# EAGLE design MyAmpV2 (EAGLE 9.0.1)
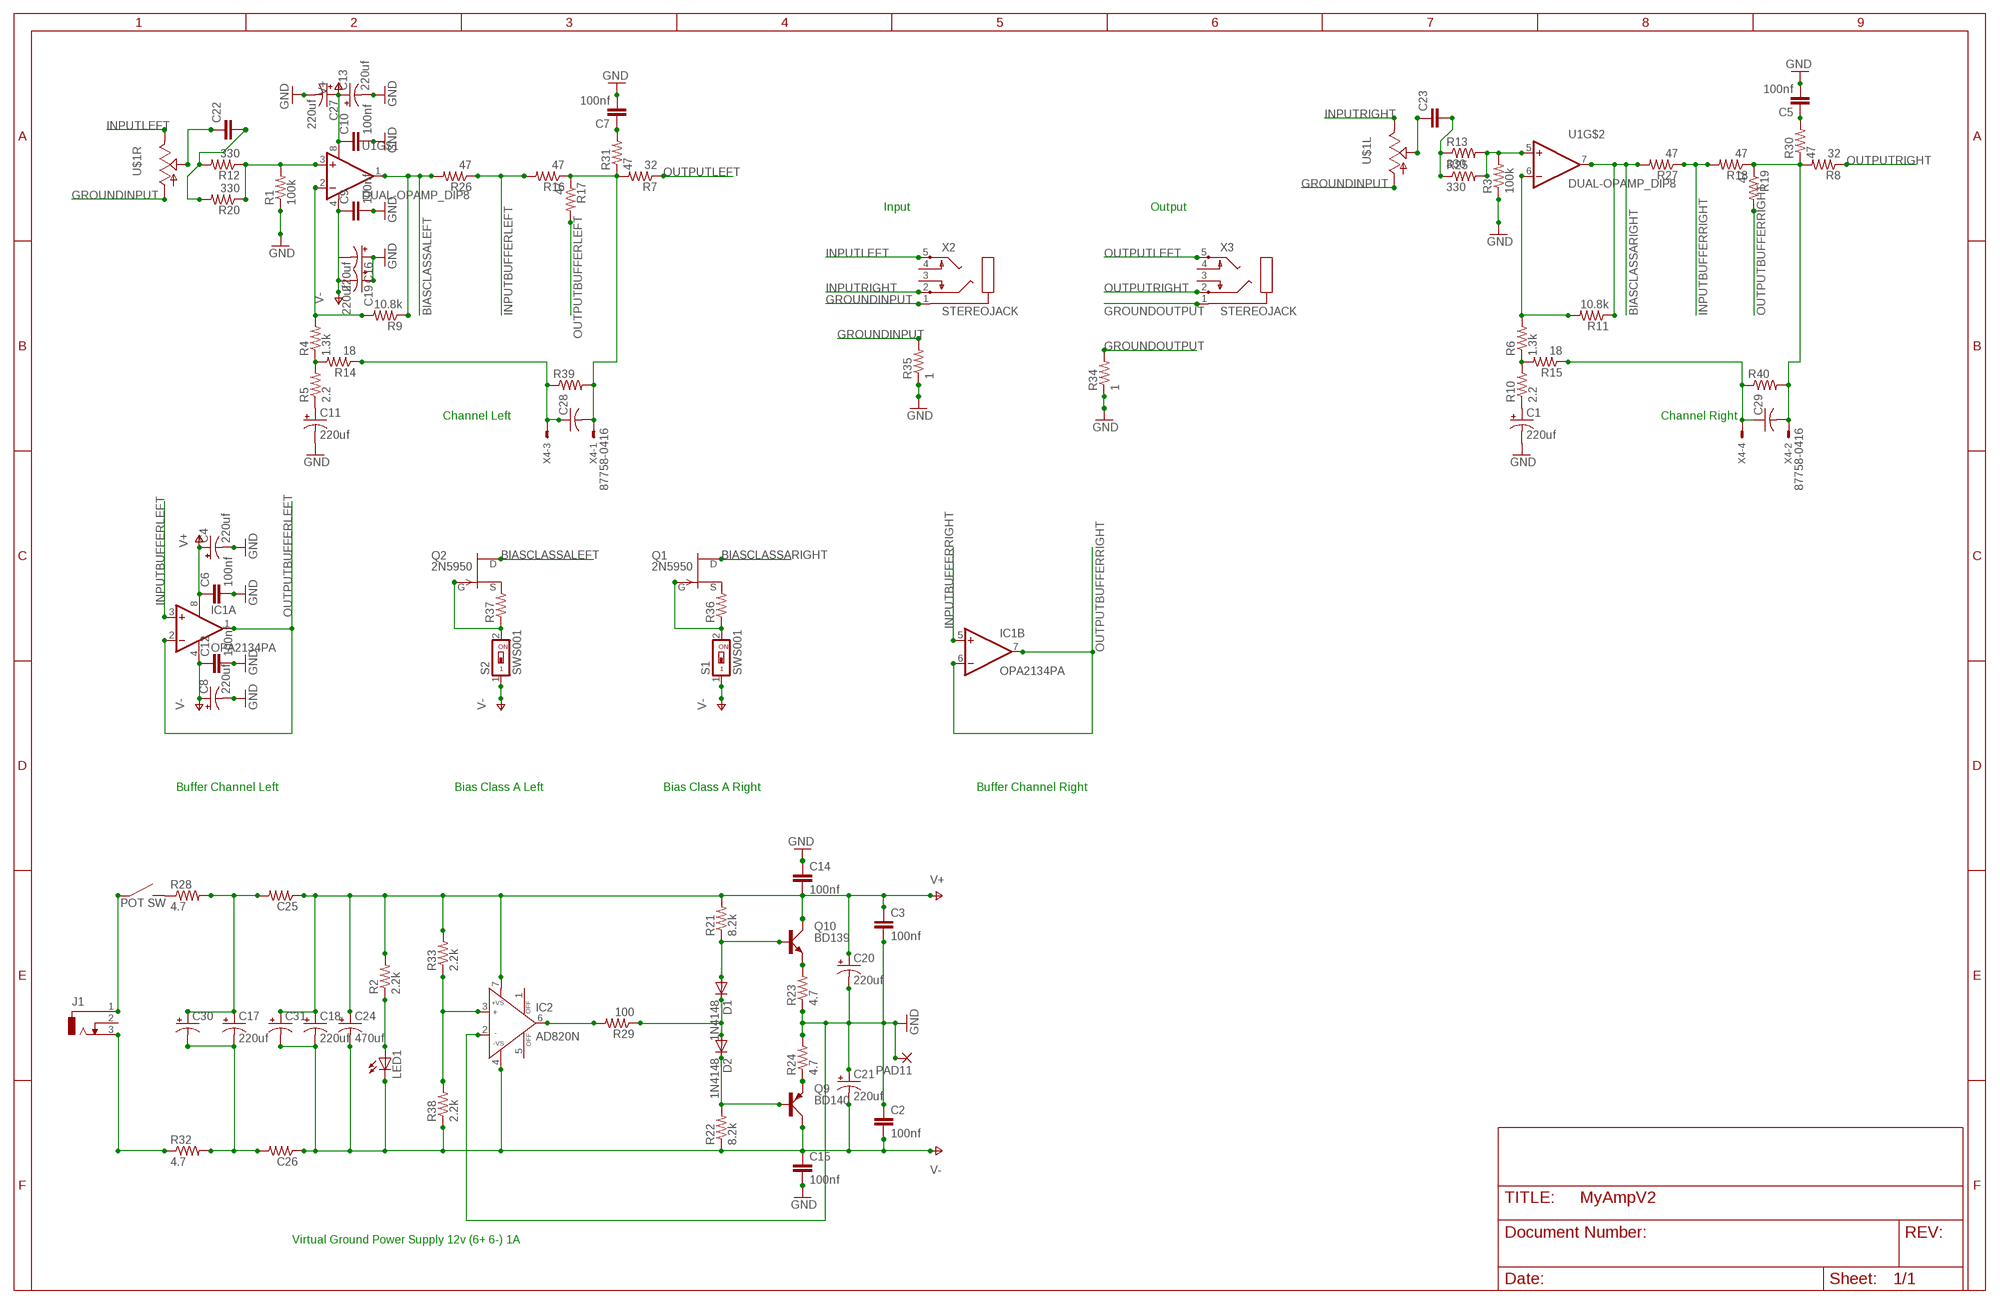
[diagram p0: schematic, sheet 1]

## Parts
C1  220uf  CPOL-USE5-10.5  [E5-10,5]
C2  100nf  C5/2.5  [C5B2.5]
C3  100nf  C5/2.5  [C5B2.5]
C4  220uf  CPOL-USE5-10.5  [E5-10,5]
C5  100nf  C5/2.5  [C5B2.5]
C6  100nf  C5/2.5  [C5B2.5]
C7  100nf  C5/2.5  [C5B2.5]
C8  220uf  CPOL-USE5-10.5  [E5-10,5]
C9  100nf  C5/2.5  [C5B2.5]
C10  100nf  C5/2.5  [C5B2.5]
C11  220uf  CPOL-USE5-10.5  [E5-10,5]
C12  100nf  C5/2.5  [C5B2.5]
C13  220uf  CPOL-USE5-10.5  [E5-10,5]
C14  100nf  C5/2.5  [C5B2.5]
C15  100nf  C5/2.5  [C5B2.5]
C16  220uf  CPOL-USE5-10.5  [E5-10,5]
C17  220uf  CPOL-USE5-10.5  [E5-10,5]
C18  220uf  CPOL-USE5-10.5  [E5-10,5]
C19  220uf  CPOL-USE5-10.5  [E5-10,5]
C20  220uf  CPOL-USD/7343-31R  [D/7343-31R]
C21  220uf  CPOL-USD/7343-31R  [D/7343-31R]
C22  C22/6  [C22.5B6]
C23  C22/6  [C22.5B6]
C24  470uf  CPOL-USE5-10.5  [E5-10,5]
C25  R-US_0207/12  [0207/12]
C26  R-US_0207/12  [0207/12]
C27  220uf  CPOL-USE5-10.5  [E5-10,5]
C28  C-USC1206K  [C1206K]
C29  C-USC1206K  [C1206K]
C30  CPOL-USE7.5-16  [E7,5-16]
C31  CPOL-USE7.5-16  [E7,5-16]
D1  1N4148  1N4148DO35-7  [DO35-7]
D2  1N4148  1N4148DO35-7  [DO35-7]
IC1  OPA2134PA  [DIL08]
IC2  AD820N  [DIL08]
J1  DCJ0303  [DCJ0303]
LED1  LED3MM  [LED3MM]
PAD11  1,6/0,9  [1,6/0,9]
Q1  2N5950  [TO-92]
Q2  2N5950  [TO-92]
Q9  BD140  [TO126AV]
Q10  BD139  [TO126AV]
R1  100k  R-US_0207/10  [0207/10]
R2  2.2k  R-US_0207/10  [0207/10]
R3  100k  R-US_0207/10  [0207/10]
R4  1.3k  R-US_0207/10  [0207/10]
R5  2.2  R-US_0204/5  [0204/5]
R6  1.3k  R-US_0207/10  [0207/10]
R7  32  R-US_0207/12  [0207/12]
R8  32  R-US_0207/12  [0207/12]
R9  10.8k  R-US_0207/10  [0207/10]
R10  2.2  R-US_0204/5  [0204/5]
R11  10.8k  R-US_0207/10  [0207/10]
R12  330  R-US_0207/10  [0207/10]
R13  330  R-US_0207/10  [0207/10]
R14  18  R-US_0207/12  [0207/12]
R15  18  R-US_0207/12  [0207/12]
R16  47  R-US_0207/12  [0207/12]
R17  47  R-US_0207/12  [0207/12]
R18  47  R-US_0207/12  [0207/12]
R19  47  R-US_0207/12  [0207/12]
R20  330  R-US_0207/10  [0207/10]
R21  8.2k  R-US_0207/10  [0207/10]
R22  8.2k  R-US_0207/10  [0207/10]
R23  4.7  R-US_0207/10  [0207/10]
R24  4.7  R-US_0207/10  [0207/10]
R25  330  R-US_0207/10  [0207/10]
R26  47  R-US_0207/10  [0207/10]
R27  47  R-US_0207/10  [0207/10]
R28  4.7  R-US_0207/10  [0207/10]
R29  100  R-US_0207/10  [0207/10]
R30  47  R-US_0207/7  [0207/7]
R31  47  R-US_0207/7  [0207/7]
R32  4.7  R-US_0207/10  [0207/10]
R33  2.2k  R-US_0207/10  [0207/10]
R34  1  R-US_0207/7  [0207/7]
R35  1  R-US_0207/7  [0207/7]
R36  R-US_0204/5  [0204/5]
R37  R-US_0204/5  [0204/5]
R38  2.2k  R-US_0207/10  [0207/10]
R39  R-US_MELF0204W  [MINI_MELF-0204W]
R40  R-US_MELF0204W  [MINI_MELF-0204W]
S1  SWS001  [SMS-001]
S2  SWS001  [SMS-001]
U1  DUAL-OPAMP_DIP8  [DIP-8]
U$1  ALPS_RK0971221Z05  [ALPS_RK0971221Z0X]
X2  STEREOJACK  [STX3100]
X3  STEREOJACK  [STX3100]
X4  87758-0416  [87758-0416]

## Nets
BIASCLASSALEFT: Q2.3(D) R9.1 R26.2 U1.1(OUT)
BIASCLASSARIGHT: Q1.3(D) R11.1 R27.2 U1.7(OUT)
GND: C1.- C2.1 C3.2 C4.- C5.2 C6.2 C7.2 C8.- C9.2 C10.2 C11.- C12.2 C13.- C14.1 C15.2 C16.+ C19.+ C20.- C21.+ C27.- IC2.2(IN-) PAD11.1(P) R1.1 R3.1 R23.1 R24.2 R34.1 R35.1
GROUNDINPUT: R35.2 U$1.G1 U$1.G2 X2.1
GROUNDOUTPUT: R34.2 X3.1
INPUTBUFFERLEFT: IC1.3(A:+IN) R16.2 R26.1
INPUTBUFFERRIGHT: IC1.5(B:+IN) R18.2 R27.1
INPUTLEFT: U$1.I2 X2.5
INPUTRIGHT: U$1.I1 X2.2
N$1: R1.2 R12.1 R20.1 U1.3(+IN)
N$2: C1.+ R10.1
N$3: C22.2 R12.2 R20.2
N$4: C11.+ R5.1
N$5: IC2.6(OUT) R29.2
N$6: Q10.E R23.2
N$7: IC2.3(IN+) R33.1 R38.2
N$8: Q9.E R24.1
N$9: C22.1 U$1.O2
N$10: R3.2 R13.2 R25.2 U1.5(+IN)
N$11: C23.2 R13.1 R25.1
N$12: R4.1 R5.2 R14.2
N$13: R4.2 R9.2 U1.2(-IN)
N$14: R6.1 R10.2 R15.2
N$15: C23.1 U$1.O1
N$16: C29.1 R15.1 R40.1 X4.4
N$17: C28.2 R7.2 R16.1 R17.1 R31.1 R39.2 X4.1
N$18: R6.2 R11.2 U1.6(-IN)
N$19: C28.1 R14.1 R39.1 X4.3
N$21: R28.1 U$1.S2
N$22: J1.3 R32.1
N$23: C29.2 R8.2 R18.1 R19.1 R30.1 R40.2 X4.2
N$25: LED1.A R2.1
N$26: J1.1 U$1.S1
N$28: C5.1 R30.2
N$29: D1.A Q10.B R21.1
N$30: D2.C Q9.B R22.2
N$33: C17.+ C25.2 C30.+ R28.2
N$36: D1.C D2.A R29.1
N$37: C7.1 R31.2
N$40: C17.- C26.2 C30.- R32.2
N$41: Q1.2(S) R36.2
N$43: Q2.1(G) R37.1 S2.2
N$44: Q1.1(G) R36.1 S1.2
N$45: Q2.2(S) R37.2
OUTPUTBUFFERLEFT: IC1.1(A:OUT) IC1.2(A:-IN) R17.2
OUTPUTBUFFERRIGHT: IC1.6(B:-IN) IC1.7(B:OUT) R19.2
OUTPUTLEFT: R7.1 X3.5
OUTPUTRIGHT: R8.1 X3.2
V+: C3.1 C4.+ C6.1 C10.1 C13.+ C14.2 C18.+ C20.+ C24.+ C25.1 C27.+ C31.+ IC1.8(A:V+) IC2.7(+VS) Q10.C R2.2 R21.2 R33.2 U1.8(V+)
V-: C2.2 C8.+ C9.1 C12.1 C15.1 C16.- C18.- C19.- C21.- C24.- C26.1 C31.- IC1.4(A:V-) IC2.4(-VS) LED1.K(C) Q9.C R22.1 R38.1 S1.1 S2.1 U1.4(V-)
Unconnected: IC2.1(OFF) IC2.5(OFF) J1.2 X2.3 X2.4 X3.3 X3.4

## Notes on the sheet
- Input | Output
- Channel Left | Channel Right
- Buffer Channel Left | Bias Class A Left | Bias Class A Right | Buffer Channel Right
- Virtual Ground Power Supply 12v (6+ 6-) 1A

## Library data of the parts
C1 C4 C8 C11 C13 C16-C21 C24 C27 C30 C31 = rcl:CPOL-US: POLARIZED CAPACITOR, American symbol; SPICEPREFIX: C
C2 C3 C5-C7 C9 C10 C12 C14 C15 C22 C23 = capacitor-wima:C: CAPACITOR naming: grid - package width
C25 C26 R1 R3-R6 R9-R13 R20 R25 R30 R31 R34 R35 R39 R40 = resistor:R-US_: RESISTOR, American symbol
C28 C29 = rcl:C-US: CAPACITOR, American symbol; SPICEPREFIX: C
D1 D2 = diode:1N4148: DIODE high speed (Philips)
IC1 = linear:OPA2*: Dual Operational Amplifier Low Power, Single-Supply, Rail-To-Rail Operational Amplifier Source: http://focus.ti.com/lit/ds/symlink/opa2345.pdf http://focus.ti.com .. opa241.pdf http://focus.ti.com/lit/ds/symlink/opa2134.pdf
IC2 = analog-devices:AD820N: Single-Supply, Rail-to-Rail, Low Power, FET Input Op Amp Source: http://www.analog.com/static/imported-files/data_sheets/AD820.pdf; OC_FARNELL: 1438579; OC_NEWARK: unknown
J1 = con-jack:DCJ0303: DC POWER JACK Source: DCJ0303.pdf
LED1 = led:LED: LED OSRAM: - CHIPLED LG R971, LG N971, LY N971, LG Q971, LY Q971, LO R971, LY R971 LH N974, LH R974 LS Q976, LO Q976, LY Q976 LO Q996 - Hyper CHIPLED LW Q18S LB Q993, LB Q99A, LB R99A - SideLED LS A670, LO A670, LY A670, LG A670, LP A670 LB A673, LV A673, LT A673, LW A673 LH A674 LY A675 LS A676, LA A676, LO A676, LY A676, LW A676 LS A679, LY A679, LG A679 - Hyper Micro SIDELED® LS Y876, LA Y876, LO Y876, LY Y876 LT Y87S - SmartLED LW L88C, LW L88S LB L89C, LB L89S, LG L890 LS L89K, LO L89K, LY L89K LS L896, LA L896, LO L896, LY L896 - TOPLED LS T670, LO T670, LY T670, LG T670, LP T670 LSG T670, LSP T670, LSY T670, LOP T670, LYG T670 LG T671, LOG T671, LSG T671 LB T673, LV T673, LT T673, LW T673 LH T674 LS T676, LA T676, LO T676, LY T676, LB T676, LH T676, LSB T676, LW T676 LB T67C, LV T67C, LT T67C, LS T67K, LO T67K, LY T67K, LW E67C LS E67B, LA E67B, LO E67B, LY E67B, LB E67C, LV E67C, LT E67C LW T67C LS T679, LY T679, LG T679 LS T770, LO T770, LY T770, LG T770, LP T770 LB T773, LV T773, LT T773, LW T773 LH T774 LS E675, LA E675, LY E675, LS T675 LS T776, LA T776, LO T776, LY T776, LB T776 LHGB T686 LT T68C, LB T68C - Hyper Mini TOPLED® LB M676 - Mini TOPLED Santana® LG M470 LS M47K, LO M47K, LY M47K Source: http://www.osram.convergy.de LUXEON: - LUMILED® LXK2-PW12-R00, LXK2-PW12-S00, LXK2-PW14-U00, LXK2-PW14-V00 LXK2-PM12-R00, LXK2-PM12-S00, LXK2-PM14-U00 LXK2-PE12-Q00, LXK2-PE12-R00, LXK2-PE12-S00, LXK2-PE14-T00, LXK2-PE14-U00 LXK2-PB12-K00, LXK2-PB12-L00, LXK2-PB12-M00, LXK2-PB14-N00, LXK2-PB14-P00, LXK2-PB14-Q00 LXK2-PR12-L00, LXK2-PR12-M00, LXK2-PR14-Q00, LXK2-PR14-R00 LXK2-PD12-Q00, LXK2-PD12-R00, LXK2-PD12-S00 LXK2-PH12-R00, LXK2-PH12-S00 LXK2-PL12-P00, LXK2-PL12-Q00, LXK2-PL12-R00 Source: www.luxeon.com KINGBRIGHT: KA-3528ASYC Source: www.kingbright.com
PAD11 = wirepad:1,6/0,9: THROUGH-HOLE PAD
Q1 Q2 = transistor-fet:2N5950: N-Channel JFET RF Amplifier
Q9 = transistor-power:BD140: PNP TRANSISTOR
Q10 = transistor-power:BD139: NPN TRANSISTOR
R2 R7 R8 R14-R19 R21-R24 R26-R29 R32 R33 R36-R38 = resistor@1:R-US_: RESISTOR, American symbol
S1 S2 = smd-special:SWS001: SMD Dip Switch 1 pol.
U1 = opamps:DUAL-OPAMP: Generic 2-channel DIP-8 opamp
U$1 = audio-pots:ALPS_RK0971221Z0*: ALPS RK0971221Z Dual-gang 9mm potentiometer for volume control, with SPST switch -05 model: 10K with "volume" taper -0N model: 50K with traditional audio taper
X2 X3 = adafruit:STEREOJACK: MIC/HEADPHONE JACK Stereo jack with two switches. Kycon STX3100, CUI SJ1-3555NG and/or 4UCon 05544
X4 = con-molex:87758-0416: 4 Pin - 2mm Dual Row Single Wafer, Vertical T/H HDR Source: http://www.molex.com/pdm_docs/sd/877580616_sd.pdf; MF: FARNELL; MPN: 87758-0416; OC_FARNELL: 7472315; OC_NEWARK: 39K3681

## Net classes
0 default: width 0.152 mm, drill 0.152 mm, clearance 0.66 mm

## Board
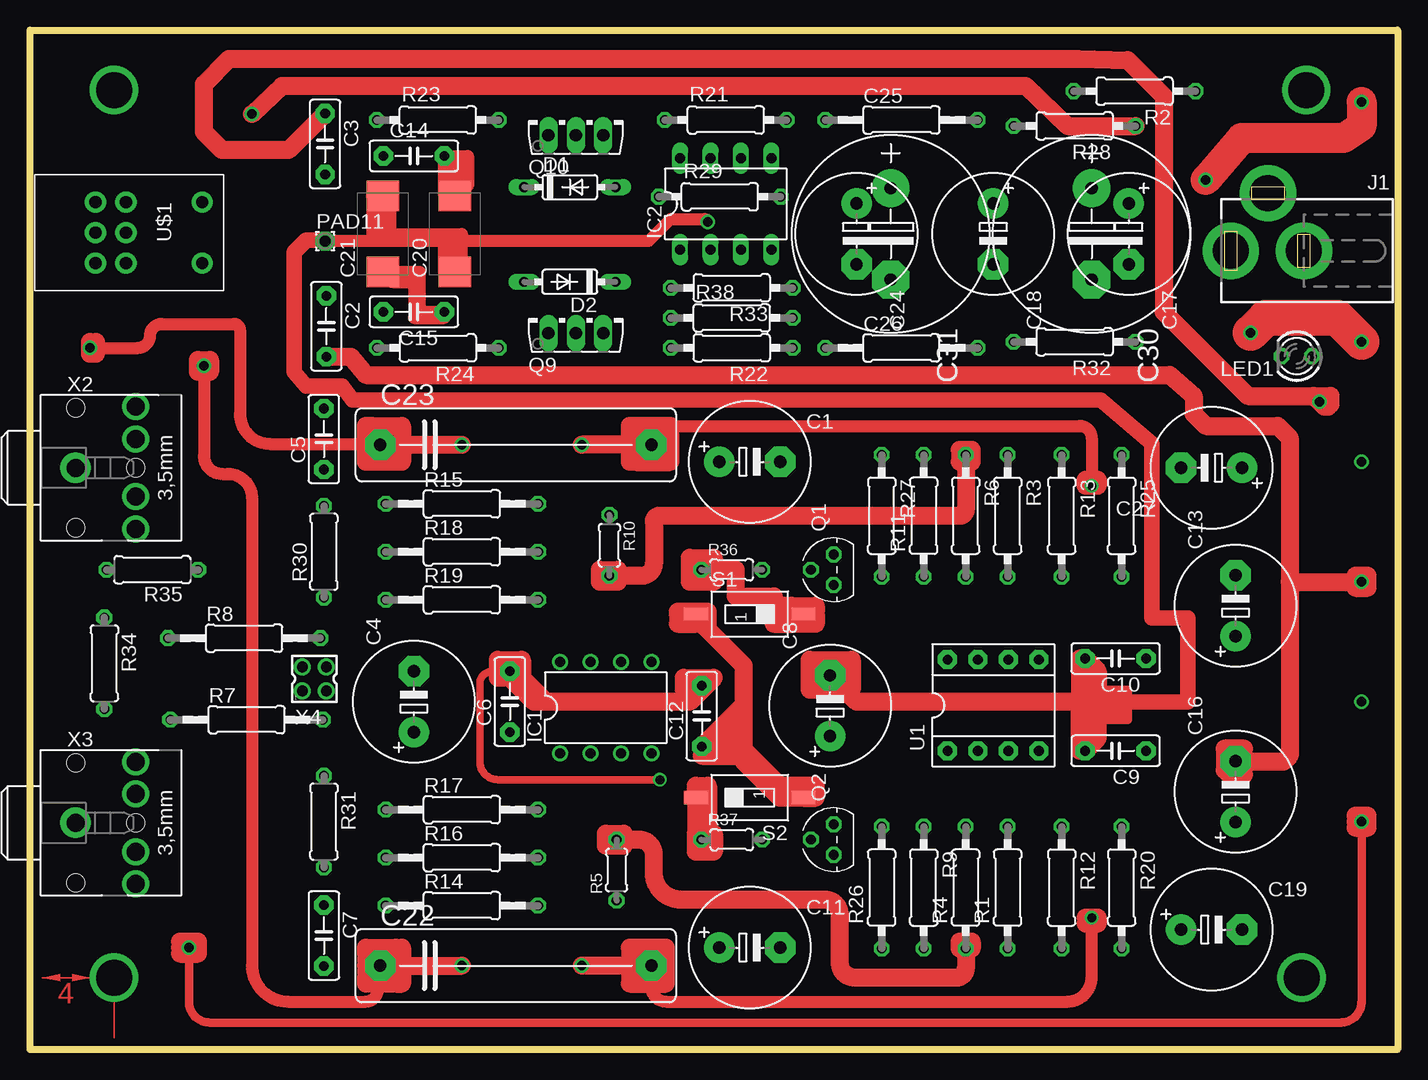
[diagram p1: board, top side]
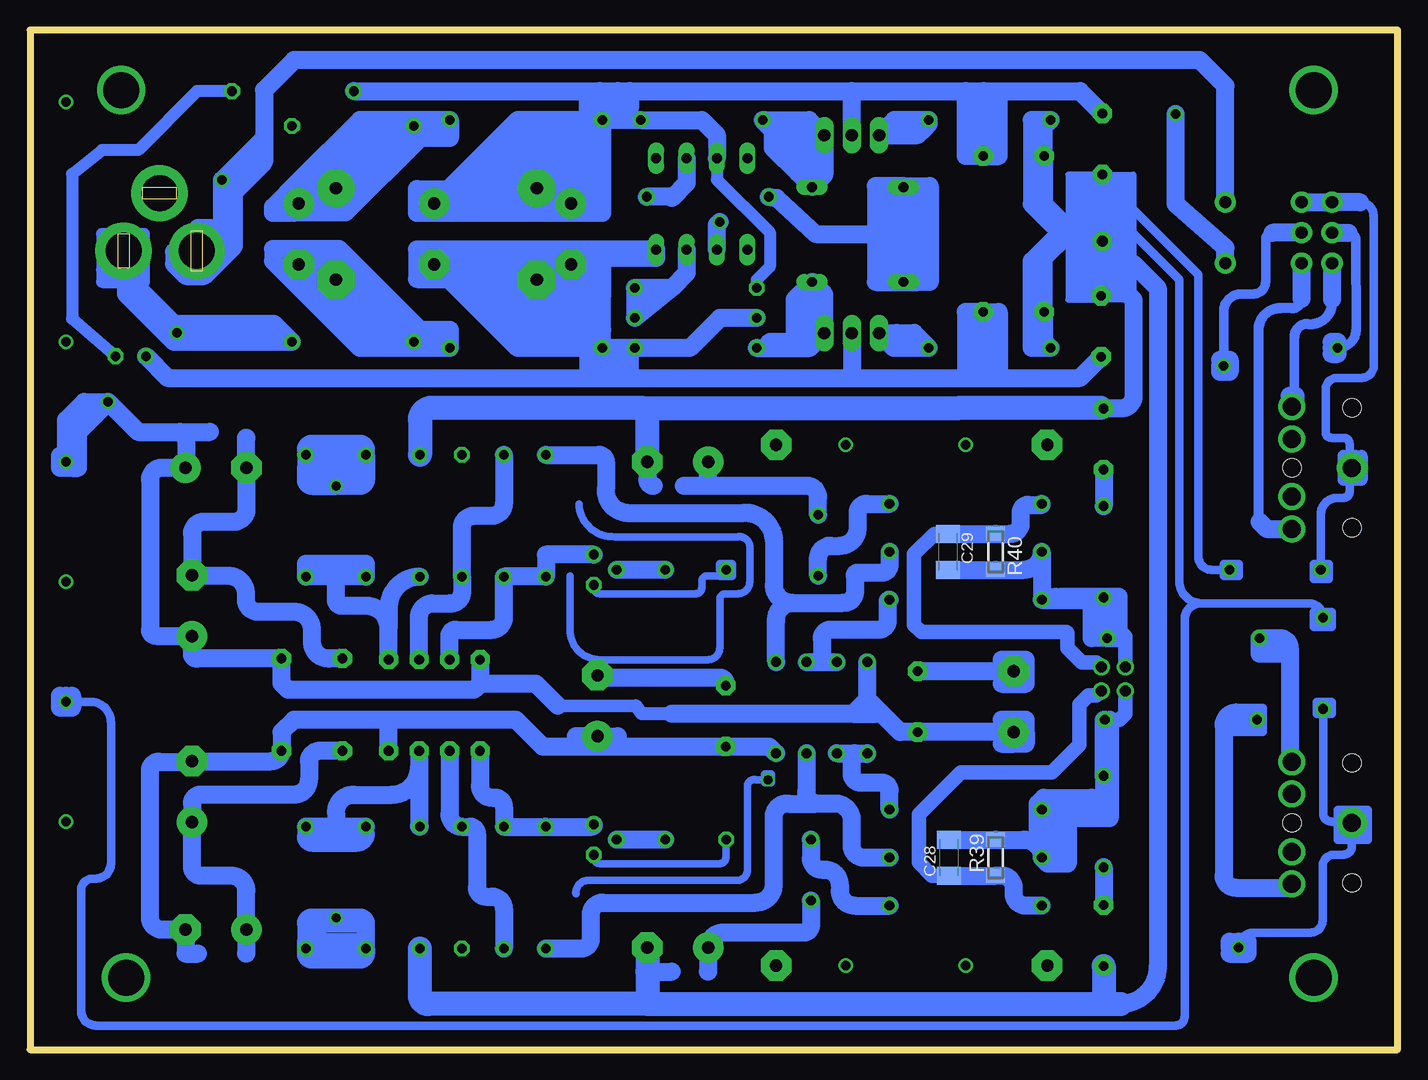
[diagram p2: board, bottom side, seen from below]

Size 114 x 85 mm. Coordinates in mm from the lower left corner, seen from the top.
Outline: 0,85 114,85 114,0 0,0 0,85
Copper layers (1*16): Top 0.035mm / dielectric 1.5mm / Bottom 0.035mm
Design rules "default *": minimum track width 10mil, minimum drill 24mil, track to track 8mil, track to pad 8mil, pad to pad 8mil, via to via 8mil, smd to smd 8mil, copper to edge 40mil, drill to drill 8mil, minimum pad ring 10mil, minimum via ring 8mil, stop-mask expansion 4mil, vias tented up to drill 0mil, thermal gap 10mil

### Footprints (pad centres in the part's own frame; a part is rotated, then mirrored left to right if it is on the bottom)
E5-10,5 = drill 1.016 pad 2.54: + -2.54,0 | drill 1.016 pad 2.54 octagon: - 2.54,0
C5B2.5 = drill 0.813 pad 1.6 octagon: 1 -2.54,0; 2 2.54,0
D/7343-31R = smd 2.55 x 2.7: + 3.175,0; - -3.175,0
C22.5B6 = drill 1.016 pad 2.54 octagon: 1 -11.303,0; 2 11.303,0
0207/12 = drill 0.813 octagon: 1 -6.35,0; 2 6.35,0
C1206K = smd 1.5 x 2: 1 -1.5,0; 2 1.5,0
E7,5-16 = drill 1.016 pad 3.15: + -3.81,0 | drill 1.016 pad 3.15 octagon: - 3.81,0
DO35-7 = drill 0.813 long: A 3.81,0; C -3.81,0
DIL08 = drill 0.813 pad 1.27: 1 -3.81,-3.81; 2 -1.27,-3.81; 3 1.27,-3.81; 4 3.81,-3.81; 5 3.81,3.81; 6 1.27,3.81; 7 -1.27,3.81; 8 -3.81,3.81
DIL08' = drill 0.813 long: 1 -3.81,-3.81; 2 -1.27,-3.81; 3 1.27,-3.81; 4 3.81,-3.81; 5 3.81,3.81; 6 1.27,3.81; 7 -1.27,3.81; 8 -3.81,3.81
DCJ0303 = drill 3 pad 4.7: 1 0,3.1; 2 4.8,0; 3 0,-3
LED3MM = drill 0.813 octagon: A -1.27,0; K 1.27,0
1,6/0,9 = drill 0.914 pad 1.6 octagon: 1 0,0
TO-92 = drill 0.813 octagon: 1 -1.27,0; 2 0,1.905; 3 1.27,0
TO126AV = drill 1.016 long: B 2.286,-1.27; C 0,-1.27; E -2.286,-1.27
0207/10 = drill 0.813 octagon: 1 -5.08,0; 2 5.08,0
0204/5 = drill 0.813 octagon: 1 -2.54,0; 2 2.54,0
0207/7 = drill 0.813 octagon: 1 -3.81,0; 2 3.81,0
MINI_MELF-0204W = smd 1.2 x 1.6: 1 -1.5,0; 2 1.5,0
SMS-001 = smd 1.092 x 2.007: 1 0,-4.496; 2 0,4.496
DIP-8 = drill 0.813 pad 1.6 octagon: 1 -3.81,3.81; 2 -3.81,1.27; 3 -3.81,-1.27; 4 -3.81,-3.81; 5 3.81,-3.81; 6 3.81,-1.27; 7 3.81,1.27; 8 3.81,3.81
ALPS_RK0971221Z0X = drill 1.016 pad 1.778: G1 2.54,-2.54; G2 0,-2.54; I1 2.54,2.54; I2 0,2.54; O1 2.54,0; O2 0,0; S1 -6.35,-2.54; S2 -6.35,2.54
STX3100 = drill 1.5 pad 2.54: 1 2.7,-0.1 | drill 1.5: 2 7.7,5; 3 7.7,2.3; 4 7.7,-2.5; 5 7.7,-5.2 | hole 1.5: 2.7,4.9; 2.7,-5.1; 7.7,-0.1
87758-0416 = drill 0.9 pad 1.27: 1 -1,-1; 2 -1,1; 3 1,-1; 4 1,1

### Placement (x,y rotation side)
C1  60,49 0 top
C2  24.7,60.3 270 top
C3  24.6,75.5 270 top
C4  32,29 90 top
C5  24.5,50.9 90 top
C6  40,29 90 top
C7  24.5,9.5 270 top
C8  66.7,28.66 90 top
C9  90.5,24.9 180 top
C10  90.5,32.6 180 top
C11  60,8.5 0 top
C12  56,27.8 90 top
C13  100.5,37 90 top
C14  32,74.5 0 top
C15  32,61.5 180 top
C16  100.5,21.5 90 top
C17  91.6,68 270 top
C18  80.3,68 270 top
C19  98.5,10 0 top
C20  35.4,68 90 top
C21  29.4,68 90 top
C22  40.5,7 0 top
C23  40.5,50.42 0 top
C24  68.9,68 270 top
C25  72.65,77.5 0 top
C26  72.65,58.5 0 top
C27  98.5,48.5 180 top
C28  37.4,16 90 bottom
C29  37.5,41.5 270 bottom
C30  88.5,68 270 top
C31  71.75,68 270 top
D1  45,71.9 0 top
D2  45,64 180 top
IC1  48,28.5 0 top
IC2  AD820N  [DIL08']  58,70.5 0 top
J1  103.2,66.6 90 top
LED1  105.6,57.8 180 top
PAD11  24.6,67.4 0 top
Q1  67,40 90 top
Q2  67,17.5 90 top
Q9  45.5,61 0 top
Q10  45.5,77.5 0 top
R1  81.5,13.5 90 top
R2  92.08,79.9 180 top
R3  81.5,44.5 270 top
R4  78,13.5 90 top
R5  48.9,14.96 90 top
R6  78,44.5 270 top
R7  18.05,27.5 0 top
R8  17.85,34.3 0 top
R9  74.5,13.5 270 top
R10  48.3,42.04 270 top
R11  74.5,44.5 90 top
R12  86,13.5 270 top
R13  86,44.5 270 top
R14  36,12 0 top
R15  36,45.5 0 top
R16  36,16 0 top
R17  36,20 0 top
R18  36,41.5 0 top
R19  36,37.5 0 top
R20  91,13.5 270 top
R21  58,77.5 0 top
R22  58.5,58.5 180 top
R23  34,77.5 0 top
R24  34,58.5 180 top
R25  91,44.5 270 top
R26  71,13.5 90 top
R27  71,44.5 270 top
R28  87.08,77 180 top
R29  57.5,71.1 0 top
R30  24.5,41.5 90 top
R31  24.5,19 270 top
R32  87.08,59 180 top
R33  58.5,63.5 180 top
R34  6.2,32.2 270 top
R35  10.2,40 180 top
R36  58.5,40 0 top
R37  58.5,17.5 0 top
R38  58.5,61 0 top
R39  33.5,16 90 bottom
R40  33.5,41.5 270 bottom
S1  60,36.3 270 top
S2  60,21 90 top
U1  80.3,28.7 90 top
U$1  8,68.1 180 top
X2  1.1,48.6 0 top
X3  1.1,19 0 top
X4  23.7,30.9 0 top

### Tracks (layer width: path | path; a pad name or v marks a point on that pad's centre or on a via)
BIASCLASSALEFT
  Bottom 1.5: U1.1 76.49,21.99 arc-90 75.5,21 75.25,21 arc90 74.5,20.25 R9.1 R26.2 67.19,18.58 arc-90 Q2.3
BIASCLASSARIGHT
  Bottom 1.5: U1.7 79.03,34.47 arc90 78.5,35 75.5,35 arc-90 74.5,36 R11.1 R27.2 71,41.27 Q1.3
GND  (via drill 0.75 pad 0.75, 0.8 pad 0.8)
  Top 0.61: v52.5,22.5 39,22.5 arc-90 37.5,24 37.5,30.5 arc-90 38.5,31.5 39.96,31.5 arc90 C6.2
  Top 0.7: 91.5,29.5 91.5,30 89,30 88.5,30 87.96,30.54 87.71,30.29 | 91.5,29.5 91.5,29 | 91.5,29 91.5,27.5 89,27.5 88.5,27.5 87.96,26.96 87.71,27.21 | 91.5,29.5 88.5,29.5 | 88.5,29.5 89,29 90.5,29 | 90.5,29 91,29 | 91,29 91.5,29 | 91,29 91,28 88.5,28 | 88.5,28 88.5,28.5 | 88.5,28.5 88.5,29.5 | 88.5,28.5 90.5,28.5 90.5,29 | 87.71,27.21 87.5,27.42 87.5,28 | 87.71,30.29 87.5,30.08 87.5,29.5 | 87.5,28 87.5,28.5 87.5,29 87.5,29.5 | 87.71,30.29 88.25,29.75 | 88.25,29.75 88.5,29.5 | 88.25,29.75 88,29.5 | 88,29.5 87.5,29.5 | 88,29.5 88,28.5 88.5,28 | 88.5,28 88,28 | 88,28 87.5,28 | 88,28 88,27.5 87.71,27.21
  Top 0.8: C10.2 87.96,30.54 | 87.96,26.96 C9.2
  Top 0.813: 24.5,67.5 arc-90 PAD11.1
  Top 1: C20.- 34.5,64.83 34.5,67.4 35,67.4
  Top 1.016: 35.4,67.4 C20.- 36,64.83 36,67 | 35.4,67.4 35,67.4 29.4,67.4 | 29.4,67.4 28.5,67.4 | 28.5,67.4 PAD11.1 | C21.+ 29.4,67.4 | 36,67.4 51.58,67.4 53.41,69.23 56.27,69.23 arc-90 v56.5,69 | 36,67.4 35.4,67.4 | C21.+ 28.5,71.17 28.5,67.4 | C21.+ 30,71.17 30,68 36,68 36,67.4
  Top 1.3: 24.5,67.5 23,67.5 22,66.5 22,56.5 23,55.3 26,55.3 26.88,54.13 89.25,54.13 93.5,50.51 93.5,36 96.5,36 96.5,29 91,29
  Top 1.5: 87.5,29 68.9,29 68.2,29.7 | 68.2,29.7 C8.- 65,31.2 | 68.5,30 68.5,32.5 65,32.5 65,31.2 | 68.2,29.7 68.2,30 65,30 65,31.2 | C12.2 54.84,30.34 54.5,30 54.5,31 57,31 55,29 43,29 | 43,29 42,29 40,31 C6.2 39.46,31 39,31 39,32.5 41,32.5 41,31 43,29 | 87.5,29.5 87.5,32.6 C10.2 89,31.56 89,30 | 87.5,28.5 87.5,24.9 C9.2 89,25.94 89,27.5
  Bottom 0.406: 22,67.4 22,73 24.6,73 C3.2 27.5,72.96 27.5,68.5 27.5,68 27.5,62.5 24.7,62.5 | PAD11.1 22,67.4 | 22,67.4 22,65.5 22,62.5 24.7,62.5 | 24.7,62.5 C2.1
  Bottom 0.6: C8.- 66.7,32.3 arc90 66.5,32.5
  Bottom 0.61: 68.5,13 arc90 67.5,14.1 55,14.1 arc-90 54.2,15 54.2,22 arc90 53.5,22.5 v52.5,22.5 | 68.25,45.5 arc-90 65.25,42.75 55,42.75 arc90 54,42 54,39 arc90 55,38 56,38 arc-90 56.5,37.5 56.5,33.5 arc90 57.5,32.5 66.5,32.5 arc90 69,35 69,39.5 | C5.2 arc-90 24.56,53.5 24.76,53.5
  Bottom 0.7: 16.4,37.2 arc90 18.2,39.2 18.2,64.2 22,68 22.5,68 | 16.4,37.2 7.39,37.2 arc90 R34.1 | 22.5,70.5 16.6,64.6 16.6,41 arc-90 15.4,40 R35.1 13.25,40 | 16.4,37.2 arc-90 17.75,35.85 17.75,2.75 arc90 18.5,2 108.5,2 arc90 109.75,3.25 109.75,13.25 arc90 108.75,14.25 108.5,14.25 arc-90 107.25,15.5 107.25,27.25 arc-90 109,29 v111,29 | 7,36.01 7,35.25 6.2,35.25 | 7,36.5 7,36.01 | 7,36.01 R34.1 | R34.1 6.2,35.25 | R34.1 6.2,36.5 5.5,36.5 5.5,35.25 6.2,35.25 | 13.25,40 13.25,40.5 14.5,40.5 14.5,39.5 13.25,39.5 13.25,40 | v52.5,22.5 52.75,22.5 52.75,22.92 52.25,22.92 52.25,22.27 52.75,22.27
  Bottom 0.813: 62.54,53.04 arc-90 63,53.5 | 100.46,39.5 arc90 C13.- | C7.2 24.46,7.5 | 62.54,3.84 62.5,3.8
  Bottom 1: C13.- arc-90 100.46,39.5
  Bottom 1.016: 36,53 arc-90 36.5,53.5
  Bottom 1.27: C3.2 24.6,72.5 22.5,72.5 22.5,70.5 22.5,68 22.5,63 27,63 27,72.5 23.5,72.5 23.5,64 26,64 26,71.5 24,71.5 24,65 | 24,64.5 24,65 | 24,65 25,65 25,70.5 24.6,70.5 PAD11.1
  Bottom 1.5: 23.1,3.8 arc-90 20,6.9 20,63.5 22,65.5 | 23.5,64 22,62.5 22,54.5 arc90 23.06,53.44 C5.2 | 27.5,68.5 29.46,70.46 C14.1 29.46,76.96 R23.1 30.5,77.5 30.5,70.5 28.75,68.75 | 27.5,68 29.46,66.04 C15.2 29.46,59.04 R24.2 30.5,58.5 30.5,65.75 28.25,68 | IC2.2 56.73,68.77 v56.5,69 | C9.2 89.85,24.9 arc-90 90.75,24 90.75,22.5 arc90 92,21.25 99.75,21.25 arc-90 100.5,20.5 C16.+ 100.5,15.25 arc-90 99.75,14.5 97.25,14.5 arc90 95.96,13.21 C19.+ 95.96,8.04 arc90 96,8 | C6.2 C4.- 32,30.5 | C10.2 89.1,32.6 arc90 90.5,34 90.5,35 arc-90 92,36.5 95,36.5 arc90 96,37.5 96,38 arc-90 97.5,39.5 100.46,39.5 arc90 C13.- 100.5,43 arc90 99.5,44 97,44 arc-90 95.96,45.04 C27.- 95.96,50.96 arc-90 96,51 | C12.2 56,30.5 arc-90 56.5,31 66.5,31 arc90 C8.- | 111,29.5 110.5,29.5 110.5,28.5 111.5,28.5 111.5,29.5 111,29.5 | v111,29 111,29.5 | 32,30.5 33,30.5 33,32.5 31,32.5 31,30.5 32,30.5 | C1.- 62.54,47.54 arc-90 62,47 | 62.54,6.5 60.5,6.5
  Bottom 2: 24.5,3.8 62.5,3.8 80.8,3.8 arc90 81.5,4.5 R1.1 | 24.5,3.8 23.1,3.8 | 24.76,53.5 36.5,53.5 63,53.5 80.5,53.5 arc-90 81.5,52.5 R3.1 | C1.- 62.54,53.04 | C11.- 62.54,6.5 62.54,3.84 | C7.2 24.5,3.8
GROUNDINPUT
  Bottom 0.7: 3.12,70.64 arc90 2,69.5 1.98,57 arc90 3,56 5,56 arc-90 6,55 6,51.5 arc-90 5.5,51 4.5,51 arc90 4,50.5 4,49.5 | 4,47.5 4,46.5 arc90 4.5,46 5,46 arc-90 6.39,44.61 R35.2 6.39,39.25 5.75,39.25 5.75,40.5 7,40.5 7,39.25 6.5,39.25
  Bottom 1: 3.5,48.5 3.5,49.5 4,49.5 4.5,49.5 4.5,47.5 4,47.5 3,47.5 3,49.5 3.8,49.5 X2.1 3.5,48.5 | 3.5,48 3.5,48.5
  Bottom 1.5: U$1.G2 U$1.G1 3.12,70.64
GROUNDOUTPUT  (via drill 0.8 pad 0.8)
  Top 0.7: v13.25,8.5 13.25,4 arc90 15,2.25 109.25,2.25 arc90 111,4 v111,19
  Top 1.5: v111,19 110.5,19 | 110.5,19 110.5,18.5 111.5,18.5 111.5,19.5 110.5,19.5 110.5,19 | v13.25,8.5 12.5,8.5 | 12.5,8.5 12.5,8 14,8 14,9 12.5,9 12.5,8.5
  Bottom 0.7: R34.2 6.2,19.7 arc-90 5.5,19 4.5,19 | X3.1 3.8,20 | 4.5,20 5,20 5,18 | 3,20 2.5,20 2.5,18.9 | 3,20 3.8,20 | 3.8,20 4.5,20 | 4.5,20 4.5,19 | 4.5,19 4.5,18.5 3.5,18.5 3.5,19.5 3.8,19.5 X3.1 | 3.8,18 3.8,16.95 arc90 4.5,16.25 5.25,16.25 arc-90 6.25,15.25 6.25,10.75 arc90 7.25,9.75 12,9.75 arc-90 v13.25,8.5 | 3,18.9 2.5,18.9 | 3,18.9 3,20 | 2.5,18.9 2.5,18 | 2.5,18 2.5,17.5 5,17.5 5,18 | 5,18 3.8,18 | X3.1 3.8,18 | 3.8,18 2.5,18 | X3.1 3,18.9 | R34.2 6.2,28 | 6.2,28 5.5,28 5.5,29 6,29 | 6,29 6.75,29 6.75,28 6.2,28 | R34.2 6,28.39 6,29
  Bottom 1.5: 14,8.5 14,8 12.5,8 12.5,8.5 | 12.5,8.5 v13.25,8.5 | 12.5,8.5 12.5,9 | v13.25,8.5 14,8.5 | 14,8.5 14,9 13.25,9 v13.25,8.5
INPUTBUFFERLEFT
  Bottom 1.5: R16.2 44.5,16 arc90 45.5,17 45.5,19.25 arc-90 47,20.5 48.5,20.5 | 48.5,20.5 arc90 49.25,21.75 49.25,24.67 arc-90 IC1.3 | 48.5,20.5 50.75,20.5 arc-90 52,19.5 52,13.75 arc90 53.5,12.25 66.25,12.25 arc-90 67.25,11.25 67.25,9.25 arc90 68.08,8.42 R26.1
INPUTBUFFERRIGHT
  Bottom 1.5: IC1.5 51.81,35.69 arc90 50.5,37.25 | 50.5,37.25 46.25,37.25 arc-90 45.25,38 45.25,39.5 arc90 45,39.75 43,39.75 arc-90 42.35,40.4 R18.2 | 50.5,37.25 arc90 52,38.75 52,42.5 arc-90 54.5,44.75 64.25,44.75 arc90 66,46.75 66,49 arc-90 66.58,49.58 R27.1
INPUTLEFT
  Bottom 0.8: 11.6,44.6 11.6,44 11.5,44
  Bottom 0.813: 8,62.6 arc90 8.8,61.8 9.8,61.8 arc-90 11.6,60 11.6,44.6
  Bottom 1.5: 8,62.6 U$1.I2 | X2.5 10.9,43.4 11.5,44
INPUTRIGHT
  Bottom 0.8: 8.6,59.4 8.6,54.5 8.5,54.5
  Bottom 0.813: 8.6,59.4 arc90 7.5,60.5 7,60.5 arc-90 5.46,62.54
  Bottom 1.5: U$1.I1 5.46,62.54 | X2.2 8.5,53.6 8.5,54.5 9,54.5 9,53.6 X2.2
N$1
  Bottom 1.5: U1.3 81.57,23.5 | 81.57,23.5 81.57,18.65 arc-90 R1.2 | R12.1 88.5,18.58 | 88.5,18.58 R20.1 91,17.75 arc-90 90.5,17.25 86.75,17.25 arc-90 86,18 | 88.5,18.58 88.5,19.75 arc90 87,21.25 83.82,21.25 arc-90 81.57,23.5
N$2
  Bottom 1.5: R10.1 48.3,46.05 arc-90 49.25,47 56.75,47 | 56.75,47 arc90 57.5,47.75 57.5,48.96 arc90 C1.+ | 56.75,47 59.5,47
N$3  (via drill 0.75 pad 0.75, 0.8 pad 0.8)
  Top 1.016: C22.2 51.8,5.2 arc90 53,4 86.5,4 arc90 88.5,6 v88.5,11
  Top 1.5: 52,8.5 53,8.5 53,5.5 50,5.5 50,8.5 51.8,8.5 C22.2 v46,7 | v88.5,11 88,11 88,10.5 89,10.5 89,11 v88.5,11
  Bottom 1.5: 86,10.5 R12.2 86,8 arc90 86.5,7.5 90.5,7.5 arc90 91,8 R20.2 | 86,10.5 arc-90 86.5,11 v88.5,11 90.5,11 arc-90 91,10.5 R20.2 | R20.2 91,9 86.5,9 | 86,10.5 90,10.5 90,10
N$4
  Bottom 1.5: R5.1 48.9,10.35 arc90 49.5,9.75 56.21,9.75 arc-90 C11.+ 57.46,6.54 arc90 57.5,6.5
N$5
  Bottom 1.5: IC2.6 59.27,72.23 60.5,71 60.6,71.1 R29.2
N$6
  Bottom 1.5: R23.2 41.94,77.5 Q10.E 40.02,76.23 39.5,76.75 39.08,77.17 R23.2
N$7
  Bottom 1.5: IC2.3 59.27,64.73 60.5,63.5 | 60.5,63.5 R33.1 R38.2 | 60.5,63.5 R38.2 | R38.2 62.75,62.75
N$8
  Bottom 1.5: 41.73,59.73 Q9.E 41.98,58.5 R24.1 40.31,59.73 41.73,59.73 | 41.73,59.73 41.25,59.25
N$9  (via drill 0.8 pad 0.8)
  Top 1.016: v14.5,57 14.5,49.5 arc90 16,48 16.5,48 arc-90 18.5,46 18.5,7 arc90 21.5,4 28,4 arc90 29,5 29,6.8 arc-90 C22.1
  Top 1.5: C22.1 29.2,6 | 29.2,6 30.5,6 | 28,7 28,6 | 28,6 29.2,6 | 30.5,6 30.5,8 | 30.5,8 28,8 | 28,8 28,7 | C22.1 28,7 | 28,8 28,8.5 30.5,8.5 | 30.5,8.5 30.5,8 | 30.5,5.5 28,5.5 28,6 | 30.5,8.5 31,8.5 31,5.5 30.5,5.5 | 30.5,6 30.5,5.5 | 14,57 14,57.5 15,57.5 15,56.5 14,56.5 14,57 | 14,57 v14.5,57 | C22.1 v36,7
  Bottom 0.8: 10.4,68.1 arc-90 11,67.5 11,64 arc90 12,63 13,63 arc-90 14.5,61.5 14.5,57.5
  Bottom 1.5: U$1.O2 10.4,68.1 | 14.79,57 14.79,56.5 14,56.5 14,57.5 14.5,57.5 14.79,57.5 14.79,57 | 14.79,57 v14.5,57
N$10
  Bottom 1.5: R13.2 88.5,39.42 | 88.5,39.42 R25.2 91,40.5 86,40.5 R13.2 | R13.2 90,40 | U1.5 84.11,35.11 | 84.11,35.11 arc-90 86,37 88,37 arc90 88.5,37.5 88.5,39.42 | R3.2 arc-90 84.11,36.81 84.11,35.11
N$11  (via drill 0.75 pad 0.75, 0.8 pad 0.8)
  Top 1.016: v88.5,47 88.5,51 arc90 87.5,52 53.38,52
  Top 1.5: 51.8,52 50.5,52 | 50.5,52 50.5,49 | 50.5,49 53.38,49 53.38,52 51.8,52 | 51.8,52 C23.2 v46,50.43 | 50.5,52 50,52 50,49 50.5,49 | v88.5,47 88,47 88,47.5 89,47.5 89,47 v88.5,47
  Bottom 1.5: R13.1 86,47.5 arc90 86.5,47 v88.5,47 90.5,47 arc90 91,47.5 91,48.5 | R25.1 91,48.5 | R13.1 86,50 arc-90 86.5,50.5 90.5,50.5 arc-90 91,50 R25.1 | R25.1 R13.1 | R13.1 90,49.58 90,48 | 91,48.5 86.5,48.5
N$12
  Top 1.5: R4.1 78,6.75 arc-90 77.25,6 68.75,6 arc-90 67.5,7.25 67.5,11.25 arc90 66.25,12.5 54.25,12.5 arc-90 52,14.75 52,16.25 arc90 50.75,17.5 R5.2 48,17.5 | 48,17.5 48,18 49.5,18 49.5,17 48,17 48,17.5 | R4.1 77.5,8.42 77.5,9 78.5,9 78.5,8.42 R4.1
  Bottom 1.5: R5.2 48.9,15.9 arc-90 48,15 47.75,15 arc90 46.5,13.75 46.5,13.25 arc-90 45.25,12 R14.2
N$13
  Bottom 1.5: U1.2 79.03,19.61 arc-90 R4.2 77.33,18.58 arc90 76.75,18 76.75,13.5 arc-90 76,12.75 75.5,12.75 arc90 74.5,11.75 R9.2
N$14
  Top 1.5: 47.5,39.5 R10.2 51,39.5 arc90 52,40.5 52,44 arc-90 52.5,44.5 77.5,44.5 arc90 78,45 R6.1 78,50 | 47.5,39.5 47.5,40 49,40 49,39 47.5,39 47.5,39.5 | 78,50 77.5,50 77.5,49 78.5,49 78.5,50 78,50
  Bottom 0.813: 48.5,39.7 arc-90 R10.2
  Bottom 1.5: R10.2 48.3,40.95 arc90 47.25,42 46.5,42 arc-90 45,43.5 45,44.75 arc90 44.25,45.5 R15.2
N$15  (via drill 0.8 pad 0.8)
  Top 1.016: v5,58.5 9,58.5 arc90 10,59.5 arc-90 11,60.5 17,60.5 arc-90 17.5,60 17.5,53 arc90 20,50.5 28.5,50.5
  Top 1.5: 28.5,50.42 C23.1 v36,50.43 | 28.5,50.42 28.5,50.5 | 28.5,50.5 28.5,52 | 28.5,50.5 29.12,50.5 | 28.5,49 28.5,50.42 | 28.5,52 31,52 31,49 28.5,49 | 28.5,52 28,52 28,49 28.5,49 | v5,58.5 5,59 5.5,59 5.5,58 5,58 v5,58.5
  Bottom 0.8: 4.1,68.1 arc90 3.46,67.5 3.45,60 arc90 v5,58.5
  Bottom 1.5: U$1.O1 4.1,68.1 | v5,58.5 5.5,58.5 | v5,58.5 5,59 5.5,59 5.5,58 5,58 v5,58.5
N$16
  Bottom 1.2: C29.1 38.6,43 40.3,41.3 40.3,35.4 39.7,34.8 27.6,34.8 27.51,34.71 27.51,33.47 26.33,32.29 25.09,32.29 X4.4
  Bottom 1.5: C29.1 R40.1 32.3,43 arc-90 31.4,43.9 31.4,44.8 arc90 30.8,45.4 29.75,45.4 arc-90 R15.1
N$17
  Bottom 1.2: X4.1 22.7,28 23.2,27.5 R7.2
  Bottom 1.5: 27.75,20 25.75,20 arc-90 24.5,21.25 R31.1 24.5,27.4 arc90 R7.2 24,27.5 24,19.3 27.1,19.3 | 27.75,20 R17.1 | 27.75,19.75 27.75,20 | C28.2 R39.2 31.15,17.5 arc90 R16.1 29.15,15.5 27.5,15.5 27.5,19 28.5,20 R17.1 | R17.1 28.15,18.5 28,18.5 28,16.5 28.5,16 30,17.5 30,20.5 29.5,21 25.5,21 | R17.1 29.65,18.15 29,17.5
N$18
  Bottom 1.5: R11.2 74.5,45.5 arc90 75.5,44.5 77,44.5 arc-90 78,43.5 R6.2 78,38 arc90 79,37.2 80.5,37.2 arc-90 81.57,35.93 U1.6
N$19
  Bottom 1.2: C28.1 38.8,14.5 39.9,15.6 39.9,19.6 36.4,23.1 28.8,23.1 26.51,25.39 26.51,28.77 25.77,29.51 25.09,29.51 X4.3
  Bottom 1.5: C28.1 R39.1 33,14.5 arc90 32,13.5 32,13 arc-90 31,12 R14.1
N$21  (via drill 0.8 pad 0.8)
  Top 1.5: v18.5,78 21,80.35 83,80.35 86.5,77 R28.1
  Bottom 1.5: U$1.S2 14.35,66.85 18.5,70.5 v18.5,78
N$22  (via drill 0.8 pad 0.8)
  Top 3: v111,59 109,61 103,61 v101.75,59.75
  Bottom 1: J1.3 106.2,65.5 | 106.2,65.5 106.2,64.2 arc-90 106,64 105,64 | 105,64 104.5,64 104.5,68 108,68 108,66.5 | 108,66.5 108,65 | 108,65 108,64 106.5,64 | J1.3 107.9,66.6 arc-90 108,66.5 | J1.3 106.4,66.6 arc-90 107,66 | J1.3 106.2,66.3 arc90 107,65.5 106.2,65.5 | 108,65 107,65 | J1.3 106.6,66.6 arc90 107.5,67.5 | J1.3 106.2,67.2 arc-90 106.5,67.5 | J1.3 106.2,66.8 arc90 105.5,67.5 | J1.3 105.4,66.6 arc-90 105,67 | 106.1,66.6 arc90 105.5,66 | J1.3 106.1,66.6 | 106.1,66.6 arc90 105,65.5 | J1.3 106.2,65.7 arc-90 105.5,65 | 106.2,65.2 arc-90 105,64 | J1.3 106.2,65.2 | 106.2,65.2 arc-90 105,64
  Bottom 1.27: v101.75,59.75 101.75,60.25 102,60.5
  Bottom 1.5: 106,64 106,63 102,59 R32.1 93.66,60.5 102,60.5 105,63.5
N$23
  Bottom 0.7: 23.6,33.95 23.25,34.3 22.7,34.3
  Bottom 1.2: X4.2 22.7,34.45 23.25,35
  Bottom 1.5: R19.1 R18.1 arc90 31.15,40 R40.2 C29.2 | R8.2 24.2,37.39 arc-90 R30.1 | R30.1 28,37.69 | 28,37.69 29.46,37.69 arc-90 R19.1 | R19.1 24.69,37.5 arc-90 R30.1 | R8.2 25.5,34.3 25.5,37 | R8.2 23.25,34.3 23.25,35 23.25,37.75 28,37.75 | 28,37.75 28,37.69 | 28.5,37.75 28,37.75
N$25
  Bottom 0.813: 107.07,58 arc90 LED1.A | 97.26,80 arc90 R2.1
  Bottom 1.016: R2.1 100.1,79.9 105,75 108,75 110.5,73 110.5,60.93 107.07,58
N$26  (via drill 0.8 pad 0.8)
  Top 2.5: v111,79 111,77 109.5,76 101,76 v98,72.5
  Bottom 1.5: 94.5,76 94.5,80 92,82.5 16.5,82.5 14.35,80.35 U$1.S1 | 94.5,76 v98,72.5 98,67.7 J1.1 | 94.5,76 94.5,74 97,71.5 97,67 99.5,64.5 101,64.5 102,65.5 102,66.5 100,68.5 99,68.5 99,67.7 J1.1 | J1.1 100.1,66.4 101,65.5 | J1.1 100,66.5 100,65.5 | J1.1 99.6,66.6 99,66
N$27  (via drill 3 pad 3.81)
  other vias: 106,6
N$28
  Bottom 1.5: C5.1 R30.2
N$29
  Bottom 1.5: R21.1 49.06,77.5 Q10.B 47.79,72.92 D1.A | D1.A 49,72.09 49,76 51.42,76 R21.1 | D1.A 50,73.09 | 50,73.09 50,74.75 52.75,77.5 R21.1 | 50,73.09 52.07,75.16 52.07,76.65 R21.1
N$30
  Bottom 1.5: R22.2 50,58.5 | 50,58.5 49.02,58.5 Q9.B 47.79,62.98 D2.C | D2.C 48.81,60.44 50.25,59 52.29,59 52.4,58.9 | D2.C 50.25,62.56 50.25,58.75 50,58.5
N$32
  cutout Bottom: 1,84 113,84 113,1 1,1
N$33
  Bottom 1.5: 81.5,77.5 C25.2 79,76 81.5,76 87.72,69.78 89.22,69.78 | 81.5,77.5 R28.2 | R28.2 83.62,75.38 | 83.62,75.38 88.46,70.54 | 88.46,70.54 89.22,69.78 | R28.2 82.5,76.5 86,76.5 91.5,71 | 83.62,75.38 85.62,75.38 90,71 91.5,71 | C17.+ 91.6,71 | 91.6,72.4 91.6,71 | 81.5,77.5 86.5,77.5 91.6,72.4 | 91.5,71 91.6,71 | 88.46,70.54 C17.+ | 89.22,69.78 91.97,69.78 92,69.75 | C17.+ 92.39,69.75 93.75,69.75 93.75,70.25 91.6,72.4
  Bottom 2.54: C30.+ 89.77,70.54 C17.+
N$34  (via drill 3 pad 3.81)
  other vias: 106.4,80
N$35  (via drill 3 pad 3.81)
  other vias: 7,80
N$36
  Bottom 1.5: 41.19,68 D2.A | R29.1 51.75,71 48.5,68 42.5,68 | 42.5,68 41.19,68 | D1.C 41.19,68 | 41.19,68 39,68 | 39,68 39,64 D2.A | D2.A 40,64 40,67 | 41.19,72 39,72 39,68 | D1.C 40,71.9 40,69 | D1.C 41.19,72 | 41.19,72 43.5,72 43.5,64 D2.A | D2.A 41.19,67 42.5,67 42.5,65 | 42.5,68 42.5,71
N$37
  Bottom 1.5: R31.2 C7.1
N$38  (via drill 3 pad 3.81)
  other vias: 7,6
N$40
  Bottom 1.5: 81.5,58.5 C26.2 79,60 81.5,60 88.25,66.75 93.75,66.75 93.75,65.75 92.12,64.12 | 81.5,58.5 R32.2 82.5,59.5 | 82.5,59.5 89.22,66.22 | 81.5,58.5 83.88,58.5 | 90.19,64.81 83.88,58.5 | 82.5,59.5 83.5,59.5 88.12,64.12 | 88.12,64.12 89.5,65.5 91.6,65.5 C17.- | 90.88,64.12 88.12,64.12 | 83.88,58.5 86.5,58.5 92.12,64.12 | 92.12,64.12 90.88,64.12 | 90.88,64.12 86,59.25
  Bottom 2.54: C30.- 90.33,64.19 C17.-
N$41
  Bottom 1.5: R36.2 Q1.2
N$43
  Top 1.5: 55.5,18 S2.2 55.5,22 56.5,22 56.5,18 | R37.1 55.5,17.5 | 55.5,18 56.5,18 | 56.5,18 57,18 57,16.5 55.5,16.5 55.5,17.5 | 55.5,17.5 55.5,18
  Bottom 0.61: Q2.1 67,16 arc-90 66.5,15.5 56.5,15.5 arc-90 56,16 56,16.96 arc90 R37.1
  Bottom 0.813: 56,17.46 arc90 R37.1
N$44
  Top 1.5: 62,37 62,37.78 58.82,37.78 58.82,40 R36.1 55,40 | 55,40 55,41 57,41 57,39 55,39 55,40 | 63.5,35.5 65.5,35.5 65.5,36.3 S1.2 62,36.3 | 63.5,35.5 63.5,37 | 63.5,37 65.5,37 65.5,36.5 | 63.5,37 62,37 | 62,36.3 62,37 | 63.5,35.5 62,35.5 62,36.3
  Bottom 0.61: Q1.1 67,38.5 arc-90 66.5,38 58.5,38 arc-90 58,38.5 58,39 arc90 57.5,39.5 56.46,39.5
  Bottom 0.7: 56.46,39.5 55.5,39.5 55.5,40.5 56,40.5 56,40 R36.1 55.96,40.5 56.5,40.5 56.5,40
N$45
  Bottom 1.5: R37.2 Q2.2
OUTPUTBUFFERLEFT
  Bottom 1.5: IC1.2 45.25,24.69 | 45.25,24.69 IC1.1 arc-90 44.25,24.63 | R17.2 42.35,21.6 arc-90 43,22.25 44.75,22.25 arc90 45.5,23 45.5,24.44 arc90 45.25,24.69
OUTPUTBUFFERRIGHT
  Bottom 1.5: IC1.6 47.75,32.31 | 47.75,32.31 IC1.7 | R19.2 arc-90 42.5,37.35 42.5,35.75 arc90 43.25,35 47.25,35 arc-90 48,34.25 48,32.56 arc-90 47.75,32.31
OUTPUTLEFT
  Bottom 0.7: 13.4,28.1 13.4,28.5 11.25,28.5 11.25,26.5 13.75,26.5
  Bottom 1.5: 14.5,27 arc90 13.4,28.1 R7.1 11.7,27 14.5,27 | 14.5,27 14.5,14.5 arc-90 13.5,13.5 9.1,13.5 arc-90 X3.5
OUTPUTRIGHT
  Bottom 1.5: 9.8,34.3 R8.1 11.5,33 9.8,33 | 9.8,34.3 arc90 9,33.5 9,33 | 9,33 9,24.2 arc-90 X3.2 | 9.8,34.3 9.8,33 | 9,33 9.8,33
V+  (via drill 0.8 pad 0.8)
  Top 1.016: C20.+ 34.54,71.17 C14.2 | C14.2 36.5,74.5 36.5,72 | C14.2 34.54,73.5 36,73.5 36,73 35,73 35,72.5 35.5,72.5
  Top 1.5: C3.1 21.56,75 16,75 14.5,76.5 14.5,80.5 16.6,82.6 87.39,82.6 91.5,82.5 94.5,79.5 94.5,61.5 101.5,54.5 107,54.5 | 107,54.5 v107.5,54 107.9,53.6 108.2,53.6 108.4,53.8 108.4,54.5 107,54.5
  Bottom 0.61: 24.56,78 arc90 C3.1
  Bottom 0.813: 100.54,34.5 arc90 C13.+
  Bottom 1: 93,32.56 arc-90 C10.1 | C13.+ arc-90 100.54,34.5 | R33.2 53.42,64.15 52.32,65.25 52.32,68.13 56.73,72.54 IC2.7
  Bottom 1.016: 66.3,79.7 66.5,79.9
  Bottom 1.1: 60.5,28 63,28 63.5,28.67 70,28.66
  Bottom 1.5: R2.2 66.5,79.9 65,79.9 | 65,79.9 64,79.9 | 64,79.9 45.5,79.9 | 45.5,79.9 36,79.9 | 36,79.9 34.5,79.9 | 34.5,79.9 26.46,79.9 C3.1 | C25.1 67.5,77.5 67.5,79.25 | 65,77.5 R21.2 58,77.5 56.73,76.23 IC2.7 | 65,77.5 C25.1 | C25.1 66.3,79.7 | C25.1 66.3,73.14 | 66.3,73.14 C24.+ | Q10.C 45.5,79.9 | C14.2 34.54,79.86 34.5,79.9 | v107.5,54 105,51.5 101.5,51.5 | 101.5,51.5 101,51 101,48.54 C27.+ 103,48.5 arc-90 104,47.5 104,35 arc-90 103.5,34.5 100.54,34.5 arc90 C13.+ 100.5,33 arc-90 100.1,32.6 C10.1 93.04,30.54 92.5,30 77,30 76.49,30.51 | 65,77.5 65,79.9 | 64,79.9 64,78.5 | C14.2 33.25,74.5 33.25,79.25 | C14.2 36,74.5 36,79.9 | C24.+ 70.46,70.54 | C25.1 73.34,77.5 C18.+ 77.5,70.54 | 77.5,70.54 71.5,70.54 | 71.5,70.54 70.46,70.54 | 70.46,70.54 67.75,73.25 67.75,73.5 67.5,73.75 67.5,75 | 67.5,75 67.5,76.5 72.75,76.5 78,71.25 | 77.5,70.54 76.02,72.02 | 76.02,72.02 72.54,75.5 71.75,75.5 | 71.75,75.5 68,75.5 | 67.5,75 68.62,73.88 | 68.62,73.88 71.5,71 | 71.5,71 71.5,70.54 | 71.5,71 72,71.5 75.5,71.5 | 76.02,72.02 74.48,72.02 73.5,73 | 73.5,73 71.75,74.75 | 71.75,75.5 71,74.75 69,74.75 | 68.62,73.88 70.12,73.88 71.75,72.25 72,72.5 73,72.5 | 73.5,73 72,73 71,74 | 66.3,73.14 66.3,69.75 81.75,69.75 81.75,71.75 78.25,71.75 | C24.+ 67,70.54 67,71 | C4.+ C6.1 41.46,26.46 43.25,28.25 | 44.19,29.19 IC1.8 | 43.25,28.25 44.19,29.19 | 44.19,29.19 45.38,28 | 45.38,28 60.5,28 | U1.8 76.49,30.51 | v107.5,54 109.5,54 111,52.5 v111,49 111.5,49 | 110.5,48.5 111.5,48.5 111.5,49 | 111.5,49 111.5,49.5 110.5,49.5 110.5,48.5 | v107.5,54 109.5,52 | 109.5,52 110.5,52 | 109.5,52 110,51.5 110,48.5 110.5,48.5 | C4.+ 32,27.5 | 32,27.5 33,27.5 33,25.5 32,25.5 | 32,25.5 C4.+ | 31,26.46 31,27.5 32,27.5
  Bottom 1.5: C4.+ 31,26.46 | 31,26.46 31,25.5 32,25.5 | 45.38,28 43.5,28 43.25,28.25 | 76.49,30.51 71.85,30.51 70,28.66 | 101.5,51.5 99,51.5
  Bottom 2.54: C31.+ 70.48,70.54 C24.+
V-  (via drill 0.8 pad 0.8)
  Top 0.813: 100.54,24 arc-90 C16.-
  Top 1.016: 31.5,64 30.23,64 arc-90 C21.- 32.5,64.83 32.5,61.5 C15.1 34.54,61.04 arc-90 34.5,61 32,61 32,63.5 arc90 31.5,64 | 31.5,64 32,64
  Top 1.5: C2.2 26.74,57.76 28,56.25 95,56.25 97,54.5 97,53 98,52 104,52 105,51 105,39 | 105,39 105,24.5 104.5,24 101.3,24 | 101.3,24 100.54,24 | 105,39 v111,39 111,39.5 | 59.5,28.76 C12.1 56,24.5 59,24.5 | 59.5,28.76 59.5,32 56.25,35.25 56.5,35.25 56.5,36.5 54,36.5 54,36.3 | 59.5,25 59.5,24 62.5,21 S2.1 65.5,21 65.5,22 62.5,22 59.5,25 | 59.5,25 59.5,28.76 | 54,36.3 S1.1 | 54,36.3 54,35.5 55.5,35.5 | 59.5,25 58.5,25 58.5,26.5 57.5,26.5 57.5,25.5 | 111,39.5 110.5,39.5 110.5,38.5 111.5,38.5 111.5,39.5 111,39.5 | C16.- 101.2,24.04 101.2,25.1 99.6,25.1 99.6,23.3 100,22.9 101.2,22.9 101.2,23.9 101.3,24
  Bottom 0.813: 100.54,24 arc-90 C16.-
  Bottom 1.5: LED1.K 102.53,56 67.5,56 | C2.2 26.46,56 33.25,56 | 67.5,56 66.5,56 | 66.5,56 64,56 | 64,56 45.5,56 | 45.5,56 36,56 | 36,56 34.5,56 | 34.5,56 33.25,56 | C26.1 67.5,58.5 | C26.1 66.3,56.2 66.5,56 | R38.1 56.5,61 59,58.5 R22.1 65.25,58.5 | 65.25,58.5 C26.1 | C26.1 66.3,60 | 66.3,60 66.3,62.86 | 66.3,62.86 67.47,64.03 | 67.47,64.03 C24.- | 66.3,60 67.5,60 67.5,60.75 | 67.5,60.75 67.5,61.5 | 67.5,61.5 67.5,62 | 67.5,62 68.25,62.75 | 68.25,62.75 68.9,63.4 | 68.9,63.4 C24.- | 68.9,66.69 C24.- | 68.9,66.69 IC2.4 61.81,66 66.3,66 66.3,62.86 | 67.47,64.03 67.47,65.5 67.5,65.5 | Q9.C 45.5,56 | C15.1 34.54,56.04 34.5,56 | 67.5,62 arc90 68,61.5 | 67.5,58.5 67.5,56 | 65.25,58.5 65.25,56.75 | 64,56 64,57.75 64.25,57.75 | C15.1 33.25,61.5 33.25,56 | C15.1 36,61.5 36,56 | 67.5,58.5 73.34,58.5 75.05,60.2 | 75.05,60.2 79.3,64.45 | 79.3,64.45 C18.- | 68.9,63.4 68.9,61.1 C26.1 | 68.9,66.69 79.07,66.69 | 79.07,66.69 C18.- | C24.- C18.- | C24.- 70.11,64.25 78.5,64.25 | 68.9,63.4 77.1,63.4 77.25,63.25 | 68.25,62.75 68.5,62.5 76.25,62.5 | 67.5,61.5 75.25,61.5 | 67.5,60.75 74.5,60.75 75.05,60.2 | 75.05,60.2 69.2,60.2 68.5,59.5 | 68.25,59.25 68.5,59.5 | 68.5,59.5 73.25,59.5 | 79.07,66.69 81.75,66.69 81.75,64.25 79.3,64.25 79.3,64.45 | IC1.4 52.38,25.26 C12.1 65,25.26 | 84,27.5 73.5,27.5 71.26,25.26 68.5,25.26 | 84,27.5 92,27.5 93.04,26.46 C9.1 arc90 93.9,24.04 C16.- 100.5,24 103.25,24 arc-90 104,23.25 104,11 arc-90 103,10 C19.- 101.04,8 100,8 | U1.4 84.11,27.39 84,27.5 | 68.5,25.26 66.5,25.26 | 66.5,25.26 65,25.26 | C8.+ 66.5,25.92 66.5,25.26 | C8.+ 65.01,26.12 65.01,25.99 65,25.99 65,25.26 | C8.+ 68.5,26.12 68.5,25.26
  Bottom 2.54: C31.- 70.48,65.46 C24.-
(copper drawn outside any net)
  shapes: Top area x2